# EAGLE design K0_Chrono77 (EAGLE 9.6.2)

## Sheet 1 of 2: Power Supply & MCU
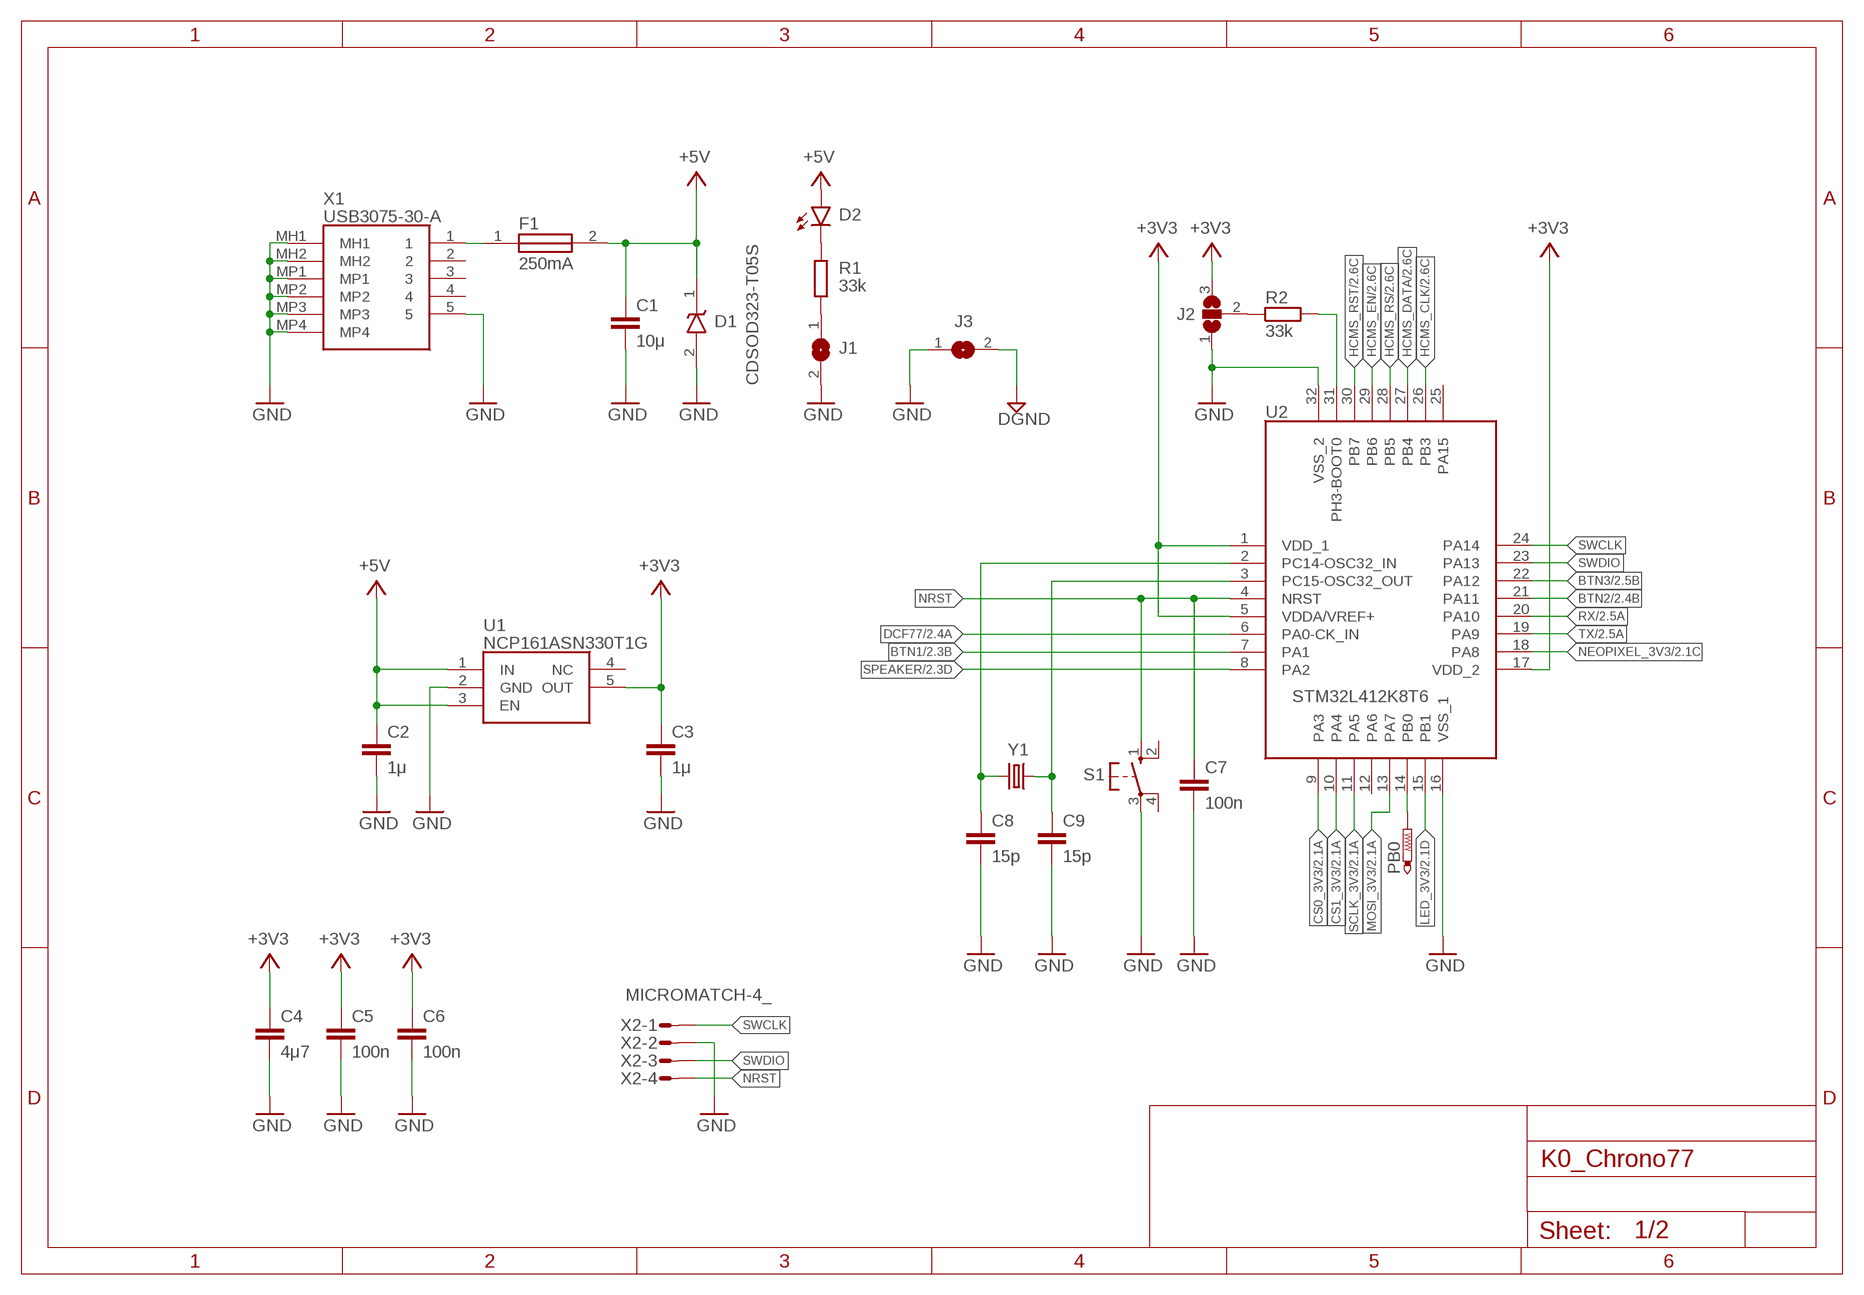
[diagram p0: schematic, sheet 1]

### Parts
C1  10μ  C_1206C1206  [C1206]
C2  1μ  C_0805  [C0805]
C3  1μ  C_0805  [C0805]
C4  4μ7  C_0805  [C0805]
C5  100n  C_0805  [C0805]
C6  100n  C_0805  [C0805]
C7  100n  C_0805  [C0805]
C8  15p  C_0805  [C0805]
C9  15p  C_0805  [C0805]
D1  CDSOD323-T05S  [SOD2513X114N]
D2  LED_0805  [CHIP-LED0805]
F1  SF-2410FP150T-2  [VARC6126X270N]
J1  SJ  [SJ]
J2  SJ2W  [SJ_2]
J3  SJ  [SJ]
PB0  PTR1TP14R  [TP14R]
R1  33k  R_0805  [R0805]
R2  33k  R_0805  [R0805]
S1  10-XX  [B3F-10XX]
U1  NCP161ASN330T1G  [SOT95P280X145-5N]
U2  STM32L412K8T6  [QFP80P900X900X160-32N]
X1  USB3075-30-A  [USB307530A]
X2  MICROMATCH-4_  [MICROMATCH-4]
Y1  CRYSTALTC26H  [TC26H]

### Nets
+3V3: C3.1 C4.1 C5.1 C6.1 J2.3 U1.5(OUT) U2.1(VDD_1) U2.5(VDDA/VREF+) U2.17(VDD_2) ; also sheet 2
+5V: C1.1 C2.1 D1.1(K) D2.A F1.2 U1.1(IN) U1.3(EN) ; also sheet 2
BTN1: U2.7(PA1) ; also sheet 2
BTN2: U2.21(PA11) ; also sheet 2
BTN3: U2.22(PA12) ; also sheet 2
CS0_3V3: U2.9(PA3) ; also sheet 2
CS1_3V3: U2.10(PA4) ; also sheet 2
DCF77: U2.6(PA0-CK_IN) ; also sheet 2
DGND: J3.2 ; also sheet 2
GND: C1.2 C2.2 C3.2 C4.2 C5.2 C6.2 C7.2 C8.2 C9.2 D1.2(A) J1.2 J2.1 J3.1 S1.3(P) U1.2(GND) U2.16(VSS_1) U2.32(VSS_2) X1.5 X1.MH1 X1.MH2 X1.MP1 X1.MP2 X1.MP3 X1.MP4 X2.2 ; also sheet 2
HCMS_CLK: U2.26(PB3) ; also sheet 2
HCMS_DATA: U2.27(PB4) ; also sheet 2
HCMS_EN: U2.29(PB6) ; also sheet 2
HCMS_RS: U2.28(PB5) ; also sheet 2
HCMS_RST: U2.30(PB7) ; also sheet 2
LED_3V3: U2.15(PB1) ; also sheet 2
MOSI_3V3: U2.13(PA7) ; also sheet 2
N$1: F1.1 X1.1
N$2: D2.C R1.2
N$3: J1.1 R1.1
N$4: R2.2 U2.31(PH3-BOOT0)
N$5: J2.2 R2.1
N$6: PB0.TP U2.14(PB0)
NEOPIXEL_3V3: U2.18(PA8) ; also sheet 2
NRST: C7.1 S1.1(S) U2.4(NRST) X2.4
OSC32_IN: C8.1 U2.2(PC14-OSC32_IN) Y1.2
OSC32_OUT: C9.1 U2.3(PC15-OSC32_OUT) Y1.1
RX: U2.20(PA10) ; also sheet 2
SCLK_3V3: U2.11(PA5) ; also sheet 2
SPEAKER: U2.8(PA2) ; also sheet 2
SWCLK: U2.24(PA14) X2.1
SWDIO: U2.23(PA13) X2.3
TX: U2.19(PA9) ; also sheet 2
Unconnected: S1.2(S1) S1.4(P1) U1.4(NC) U2.12(PA6) U2.25(PA15) X1.2 X1.3 X1.4

### Notes on the sheet
- 250mA

## Sheet 2 of 2: Additional Components
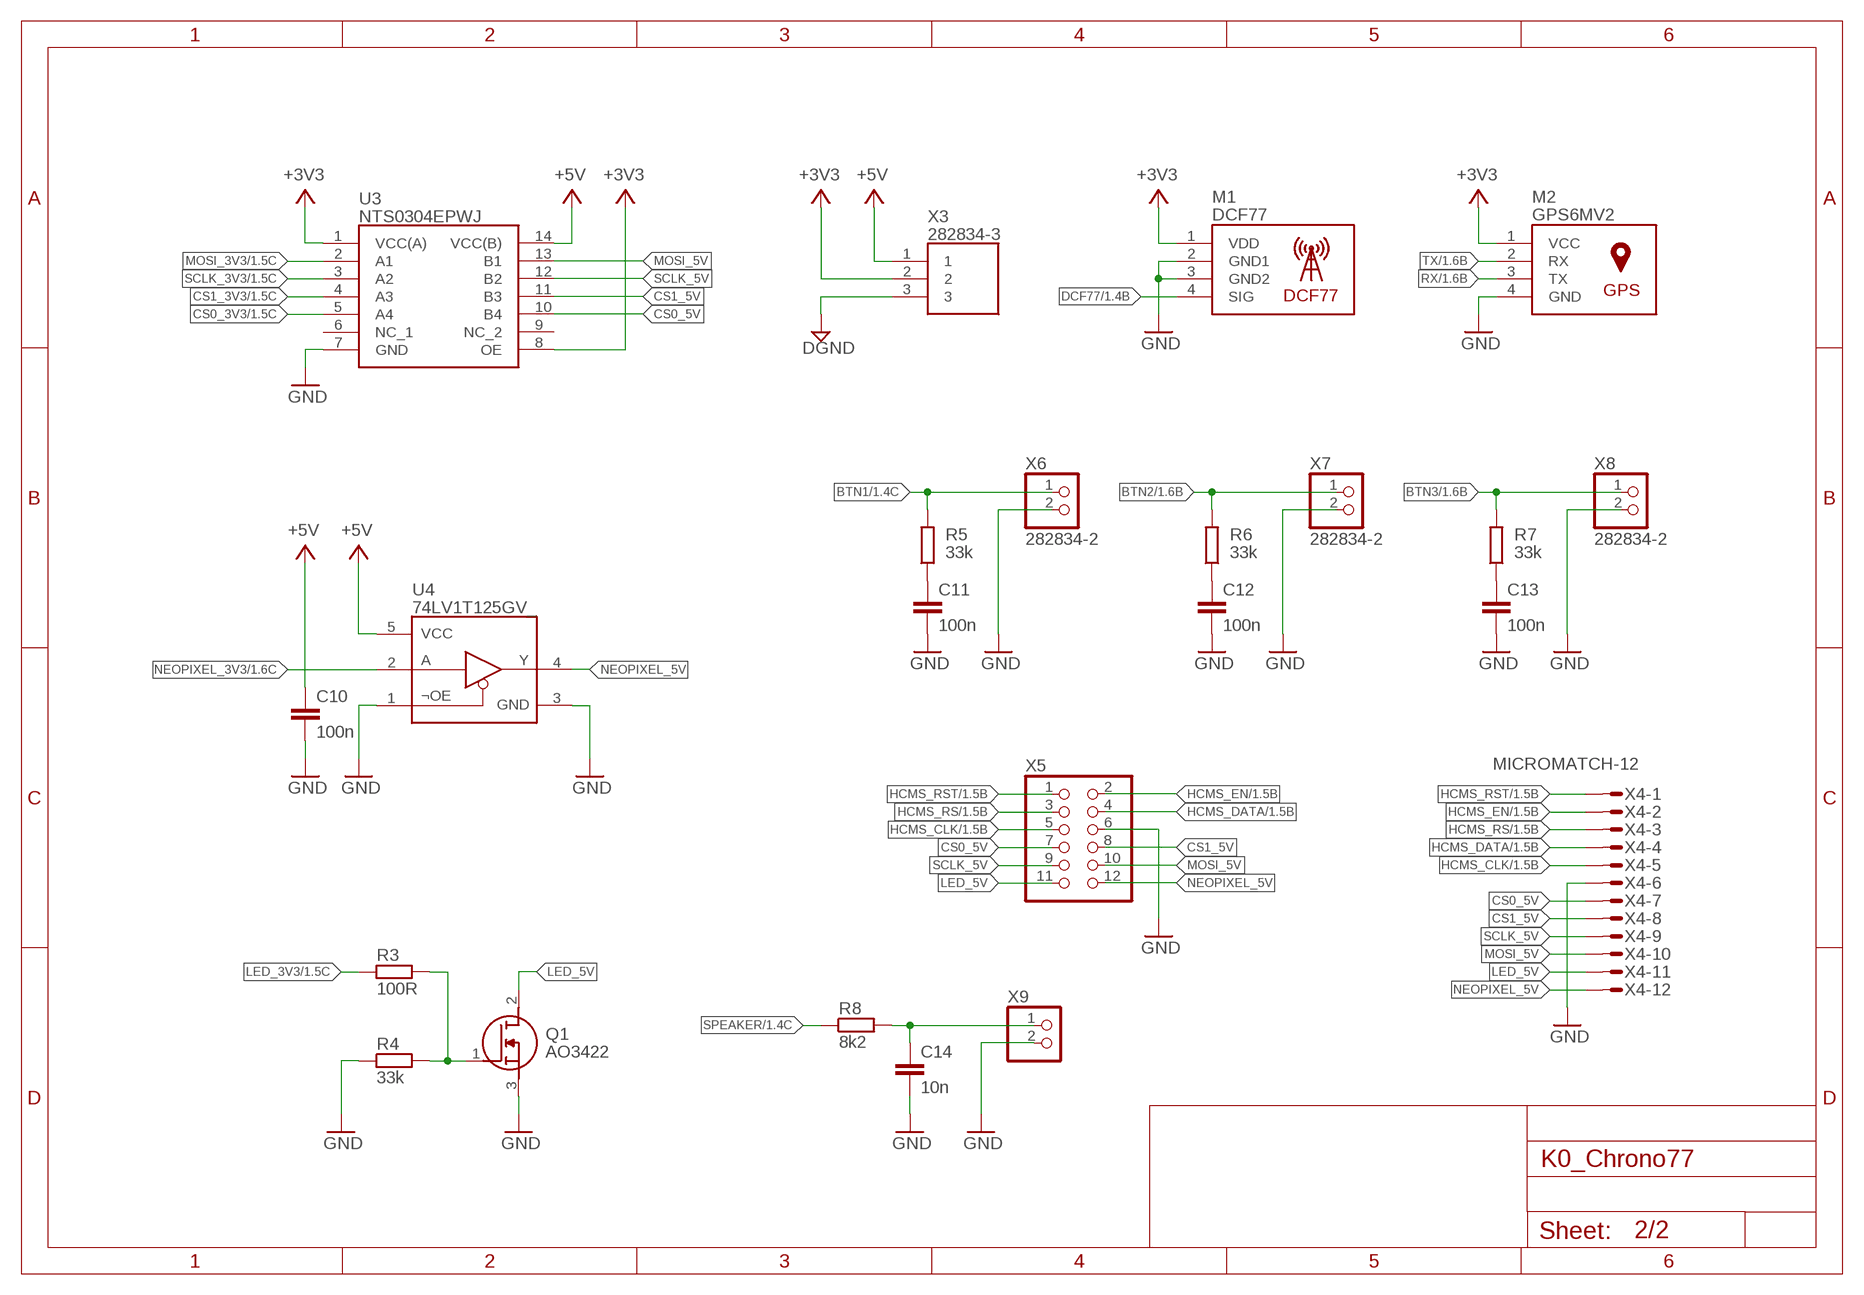
[diagram p1: schematic, sheet 2]

### Parts
C10  100n  C_0805  [C0805]
C11  100n  C_0805  [C0805]
C12  100n  C_0805  [C0805]
C13  100n  C_0805  [C0805]
C14  10n  C_0805  [C0805]
M1  DCF77  [DCF77]
M2  GPS6MV2  [GPS6MV2]
Q1  AO3422  [SOT95P237X112-3N]
R3  100R  R_0805  [R0805]
R4  33k  R_0805  [R0805]
R5  33k  R_0805  [R0805]
R6  33k  R_0805  [R0805]
R7  33k  R_0805  [R0805]
R8  8k2  R_0805  [R0805]
U3  NTS0304EPWJ  [SOP65P640X110-14N]
U4  74LV1T125GV_  [SOT753]
X3  282834-3  [SHDR3W100P0X254_1X3_808X650X10]
X4  MICROMATCH-12  [MICROMATCH-12]
X5  PINHD-2X6  [2X06]
X6  282834-2  [SHDR2W85P0X254_1X2_554X650X103]
X7  282834-2  [SHDR2W85P0X254_1X2_554X650X103]
X8  282834-2  [SHDR2W85P0X254_1X2_554X650X103]
X9  PINHD-1X2/90  [1X02/90]

### Nets
+3V3: M1.1(VDD) M2.1(VCC) U3.1(VCC(A)) U3.8(OE) X3.2 ; also sheet 1
+5V: C10.1 U3.14(VCC(B)) U4.5(VCC) X3.1 ; also sheet 1
BTN1: R5.2 X6.1 ; also sheet 1
BTN2: R6.2 X7.1 ; also sheet 1
BTN3: R7.2 X8.1 ; also sheet 1
CS0_3V3: U3.5(A4) ; also sheet 1
CS0_5V: U3.10(B4) X4.7 X5.7
CS1_3V3: U3.4(A3) ; also sheet 1
CS1_5V: U3.11(B3) X4.8 X5.8
DCF77: M1.4(SIG) ; also sheet 1
DGND: X3.3 ; also sheet 1
GND: C10.2 C11.2 C12.2 C13.2 C14.2 M1.2(GND1) M1.3(GND2) M2.4(GND) Q1.3(S) R4.1 U3.7(GND) U4.1(¬OE) U4.3(GND) X4.6 X5.6 X6.2 X7.2 X8.2 X9.2 ; also sheet 1
HCMS_CLK: X4.5 X5.5 ; also sheet 1
HCMS_DATA: X4.4 X5.4 ; also sheet 1
HCMS_EN: X4.2 X5.2 ; also sheet 1
HCMS_RS: X4.3 X5.3 ; also sheet 1
HCMS_RST: X4.1 X5.1 ; also sheet 1
LED_3V3: R3.1 ; also sheet 1
LED_5V: Q1.2(D) X4.11 X5.11
MOSI_3V3: U3.2(A1) ; also sheet 1
MOSI_5V: U3.13(B1) X4.10 X5.10
N$7: C11.1 R5.1
N$8: C12.1 R6.1
N$9: Q1.1(G) R3.2 R4.2
N$10: C13.1 R7.1
N$15: C14.1 R8.2 X9.1
NEOPIXEL_3V3: U4.2(A) ; also sheet 1
NEOPIXEL_5V: U4.4(Y) X4.12 X5.12
RX: M2.3(TX) ; also sheet 1
SCLK_3V3: U3.3(A2) ; also sheet 1
SCLK_5V: U3.12(B2) X4.9 X5.9
SPEAKER: R8.1 ; also sheet 1
TX: M2.2(RX) ; also sheet 1
Unconnected: U3.6(NC_1) U3.9(NC_2)

## Library data of the parts
C1 = K0N16_Keypad_Collection:C_1206: CAPACITOR, European symbol
C2-C14 = K0N16_Keypad_Collection:C_0805: CAPACITOR, European symbol
D1 = SamacSys_Parts:CDSOD323-T05S: ESD Suppressors / TVS Diodes Unidirectional Std Cap Source: Datasheet <https://datasheet.datasheetarchive.com/originals/dk/DKDS-12/224732.pdf>; ARROW_PART_NUMBER: CDSOD323-T03S; ARROW_PRICE-STOCK: https://www.arrow.com/en/products/cdsod323-t03s/bourns?region=nac; DESCRIPTION: ESD Suppressors / TVS Diodes Unidirectional Std Cap; HEIGHT: 1.14mm; MANUFACTURER_NAME: Bourns; MANUFACTURER_PART_NUMBER: CDSOD323-T03S; MOUSER_PART_NUMBER: 652-CDSOD323-T03S; MOUSER_PRICE-STOCK: https://www.mouser.co.uk/ProductDetail/Bourns/CDSOD323-T03S?qs=6S5Watp5UnKvHMaJwkOReA%3D%3D
D2 = K0N16_Keypad_Collection:LED_0805: LED OSRAM: - CHIPLED LG R971, LG N971, LY N971, LG Q971, LY Q971, LO R971, LY R971 LH N974, LH R974 LS Q976, LO Q976, LY Q976 LO Q996 - Hyper CHIPLED LW Q18S LB Q993, LB Q99A, LB R99A - SideLED LS A670, LO A670, LY A670, LG A670, LP A670 LB A673, LV A673, LT A673, LW A673 LH A674 LY A675 LS A676, LA A676, LO A676, LY A676, LW A676 LS A679, LY A679, LG A679 - Hyper Micro SIDELED® LS Y876, LA Y876, LO Y876, LY Y876 LT Y87S - SmartLED LW L88C, LW L88S LB L89C, LB L89S, LG L890 LS L89K, LO L89K, LY L89K LS L896, LA L896, LO L896, LY L896 - TOPLED LS T670, LO T670, LY T670, LG T670, LP T670 LSG T670, LSP T670, LSY T670, LOP T670, LYG T670 LG T671, LOG T671, LSG T671 LB T673, LV T673, LT T673, LW T673 LH T674 LS T676, LA T676, LO T676, LY T676, LB T676, LH T676, LSB T676, LW T676 LB T67C, LV T67C, LT T67C, LS T67K, LO T67K, LY T67K, LW E67C LS E67B, LA E67B, LO E67B, LY E67B, LB E67C, LV E67C, LT E67C LW T67C LS T679, LY T679, LG T679 LS T770, LO T770, LY T770, LG T770, LP T770 LB T773, LV T773, LT T773, LW T773 LH T774 LS E675, LA E675, LY E675, LS T675 LS T776, LA T776, LO T776, LY T776, LB T776 LHGB T686 LT T68C, LB T68C - Hyper Mini TOPLED® LB M676 - Mini TOPLED Santana® LG M470 LS M47K, LO M47K, LY M47K Source: http://www.osram.convergy.de LUXEON: - LUMILED® LXK2-PW12-R00, LXK2-PW12-S00, LXK2-PW14-U00, LXK2-PW14-V00 LXK2-PM12-R00, LXK2-PM12-S00, LXK2-PM14-U00 LXK2-PE12-Q00, LXK2-PE12-R00, LXK2-PE12-S00, LXK2-PE14-T00, LXK2-PE14-U00 LXK2-PB12-K00, LXK2-PB12-L00, LXK2-PB12-M00, LXK2-PB14-N00, LXK2-PB14-P00, LXK2-PB14-Q00 LXK2-PR12-L00, LXK2-PR12-M00, LXK2-PR14-Q00, LXK2-PR14-R00 LXK2-PD12-Q00, LXK2-PD12-R00, LXK2-PD12-S00 LXK2-PH12-R00, LXK2-PH12-S00 LXK2-PL12-P00, LXK2-PL12-Q00, LXK2-PL12-R00 Source: www.luxeon.com KINGBRIGHT: KA-3528ASYC Source: www.kingbright.com
F1 = SamacSys_Parts:SF-2410FP150T-2: Surface Mount Fuses Source: Datasheet <https://componentsearchengine.com/Datasheets/1/SF-2410FP150T-2.pdf>; ARROW_PART_NUMBER: SF-2410FP150T-2; ARROW_PRICE-STOCK: https://www.arrow.com/en/products/sf-2410fp150t-2/bourns; DESCRIPTION: Surface Mount Fuses; HEIGHT: 2.7mm; MANUFACTURER_NAME: Bourns; MANUFACTURER_PART_NUMBER: SF-2410FP150T-2; MOUSER_PART_NUMBER: 652-SF-2410FP150T-2; MOUSER_PRICE-STOCK: https://www.mouser.co.uk/ProductDetail/Bourns/SF-2410FP150T-2?qs=vLWxofP3U2ze3qY8eZya8g%3D%3D
J1 J3 = jumper:SJ: SMD solder JUMPER
J2 = jumper:SJ2W: SMD solder JUMPER
M1 = K0_Chrono77:DCF77
M2 = K0_Chrono77:GPS6MV2
PB0 = testpad:PTR1: TEST PIN
Q1 = SamacSys_Parts:AO3422: MOSFET N-CH 55V 2.1A SOT23 Source: Datasheet <http://aosmd.com/res/data_sheets/AO3422.pdf>; ARROW_PART_NUMBER: AO3422; ARROW_PRICE-STOCK: https://www.arrow.com/en/products/ao3422/alpha-and-omega-semiconductor?region=nac; DESCRIPTION: MOSFET N-CH 55V 2.1A SOT23; HEIGHT: 1.12mm; MANUFACTURER_NAME: Alpha & Omega Semiconductors; MANUFACTURER_PART_NUMBER: AO3422
R1-R8 = K0N16_Keypad_Collection:R_0805: RESISTOR, European symbol
S1 = switch-omron:10-XX: OMRON SWITCH; MPN: B3F-1000; OC_FARNELL: 176432; OC_NEWARK: 36M3542
U1 = K0N16_Keypad_Collection:NCP161ASN330T1G: ON SEMICONDUCTOR - NCP161ASN330T1G - Fixed LDO Voltage Regulator, 1.9V to 5.5V, 225mV drop, 3.3V/450mA out, SOT-23-5 Source: Datasheet <https://componentsearchengine.com/Datasheets/2/NCP161ASN330T1G.pdf>; ARROW_PART_NUMBER: NCP161ASN330T1G; ARROW_PRICE-STOCK: https://www.arrow.com/en/products/ncp161asn330t1g/on-semiconductor?region=nac; DESCRIPTION: ON SEMICONDUCTOR - NCP161ASN330T1G - Fixed LDO Voltage Regulator, 1.9V to 5.5V, 225mV drop, 3.3V/450mA out, SOT-23-5; HEIGHT: 1.45mm; MANUFACTURER_NAME: onsemi; MANUFACTURER_PART_NUMBER: NCP161ASN330T1G; MOUSER_PART_NUMBER: 863-NCP161ASN330T1G; MOUSER_PRICE-STOCK: https://www.mouser.co.uk/ProductDetail/onsemi/NCP161ASN330T1G?qs=vLWxofP3U2ze5zA%252BHmAd3w%3D%3D
U2 = K0N16_Keypad_Collection:STM32L412K8T6: STMICROELECTRONICS - STM32L412K8T6 - ARM MCU, STM32 Family STM32L4 Series Microcontrollers, ARM Cortex-M4, 32bit, 80 MHz, 128 KB, 40 KB Source: Datasheet <https://www.mouser.com/datasheet/2/389/stm32l412c8-1505426.pdf>; ARROW_PART_NUMBER: STM32L412K8T6; ARROW_PRICE-STOCK: https://www.arrow.com/en/products/stm32l412k8t6/stmicroelectronics?region=nac; DESCRIPTION: STMICROELECTRONICS - STM32L412K8T6 - ARM MCU, STM32 Family STM32L4 Series Microcontrollers, ARM Cortex-M4, 32bit, 80 MHz, 128 KB, 40 KB; HEIGHT: 1.6mm; MANUFACTURER_NAME: STMicroelectronics; MANUFACTURER_PART_NUMBER: STM32L412K8T6; MOUSER_PART_NUMBER: 511-STM32L412K8T6; MOUSER_PRICE-STOCK: https://www.mouser.co.uk/ProductDetail/STMicroelectronics/STM32L412K8T6?qs=l7cgNqFNU1gVMdP83FyqDw%3D%3D
U3 = SamacSys_Parts:NTS0304EPWJ: Translation - Voltage Levels 4-bit 0.9V Xlator w/AD & OD Source: Datasheet <http://www.nxp.com/docs/en/data-sheet/NTS0304E.pdf>; ARROW_PART_NUMBER: NTS0304EPWJ; ARROW_PRICE-STOCK: https://www.arrow.com/en/products/nts0304epwj/nxp-semiconductors?region=nac; DESCRIPTION: Translation - Voltage Levels 4-bit 0.9V Xlator w/AD & OD; HEIGHT: 1.1mm; MANUFACTURER_NAME: NXP; MANUFACTURER_PART_NUMBER: NTS0304EPWJ; MOUSER_PART_NUMBER: 771-NTS0304EPWJ; MOUSER_PRICE-STOCK: https://www.mouser.co.uk/ProductDetail/NXP-Semiconductors/NTS0304EPWJ?qs=u16ybLDytRZsxoYxiWudcg%3D%3D
U4 = K0N16_Keypad_Collection:74LV1T125GV
X1 = K0N16_Keypad_Collection:USB3075-30-A: GCT (GLOBAL CONNECTOR TECHNOLOGY) - USB3075-30-A - USB Connector, Micro USB Type B, USB 2.0, Receptacle, 5 Ways, Surface Mount, Right Angle Source: Datasheet <https://componentsearchengine.com/Datasheets/2/USB3075-30-A.pdf>; DESCRIPTION: GCT (GLOBAL CONNECTOR TECHNOLOGY) - USB3075-30-A - USB Connector, Micro USB Type B, USB 2.0, Receptacle, 5 Ways, Surface Mount, Right Angle; HEIGHT: 2.7mm; MANUFACTURER_NAME: GCT (GLOBAL CONNECTOR TECHNOLOGY); MANUFACTURER_PART_NUMBER: USB3075-30-A; MOUSER_PART_NUMBER: 640-USB3075-30-A; MOUSER_PRICE-STOCK: https://www.mouser.co.uk/ProductDetail/GCT/USB3075-30-A?qs=KUoIvG%2F9IlbGMJplbp1ybA%3D%3D
X2 = K0N16_Keypad_Collection:MICROMATCH-4: MicroMaTch 4 7-215464-4 / 0-215464-4 Drawing Number C-215464 DDEController.pdf
X3 = SamacSys_Parts:282834-3: Connector pcb 3 way 2.54mm Termi-Block Source: Datasheet <http://www.te.com/commerce/DocumentDelivery/DDEController?Action=showdoc&DocId=Customer Drawing282834C1pdfEnglishENG_CD_282834_C1.pdf282834-3>; ALLIED_NUMBER: 70087777; ALLIED_PRICE-STOCK: http://www.alliedelec.com/te-connectivity-282834-3/70087777/; DESCRIPTION: Connector pcb 3 way 2.54mm Termi-Block; HEIGHT: 10.3mm; MANUFACTURER_NAME: TE Connectivity; MANUFACTURER_PART_NUMBER: 282834-3; MOUSER_PART_NUMBER: 571-2828343; MOUSER_PRICE-STOCK: https://www.mouser.com/Search/Refine.aspx?Keyword=571-2828343; RS_PART_NUMBER: 1640792; RS_PRICE-STOCK: http://uk.rs-online.com/web/p/products/1640792
X4 = con-amp-micromatch:MICROMATCH-12: MicroMaTch 12 8-215464-2 / 1-215464-2 Drawing Number C-215464 DDEController.pdf; MF: FARNELL; MPN: 8-215464-2; OC_FARNELL: 3784666; OC_NEWARK: 95H9857
X5 = pinhead:PINHD-2X6: PIN HEADER
X6-X8 = SamacSys_Parts:282834-2: TE CONNECTIVITY / BUCHANAN - 282834-2 - TERMINAL BLOCK, WIRE TO BRD, 2POS, 16AWG Source: Datasheet <https://www.te.com/commerce/DocumentDelivery/DDEController?Action=srchrtrv&DocNm=282834&DocType=Customer Drawing&DocLang=English&DocFormat=pdf&PartCntxt=282834-2>; ALLIED_NUMBER: 70086732; ALLIED_PRICE-STOCK: https://www.alliedelec.com/te-connectivity-282834-2/70086732/; DESCRIPTION: TE CONNECTIVITY / BUCHANAN - 282834-2 - TERMINAL BLOCK, WIRE TO BRD, 2POS, 16AWG; HEIGHT: 10.3mm; MANUFACTURER_NAME: TE CONNECTIVITY / BUCHANAN; MANUFACTURER_PART_NUMBER: 282834-2
X9 = pinhead:PINHD-1X2: PIN HEADER
Y1 = crystal:CRYSTAL: CRYSTAL; OC_FARNELL: unknown; OC_NEWARK: unknown

## Board
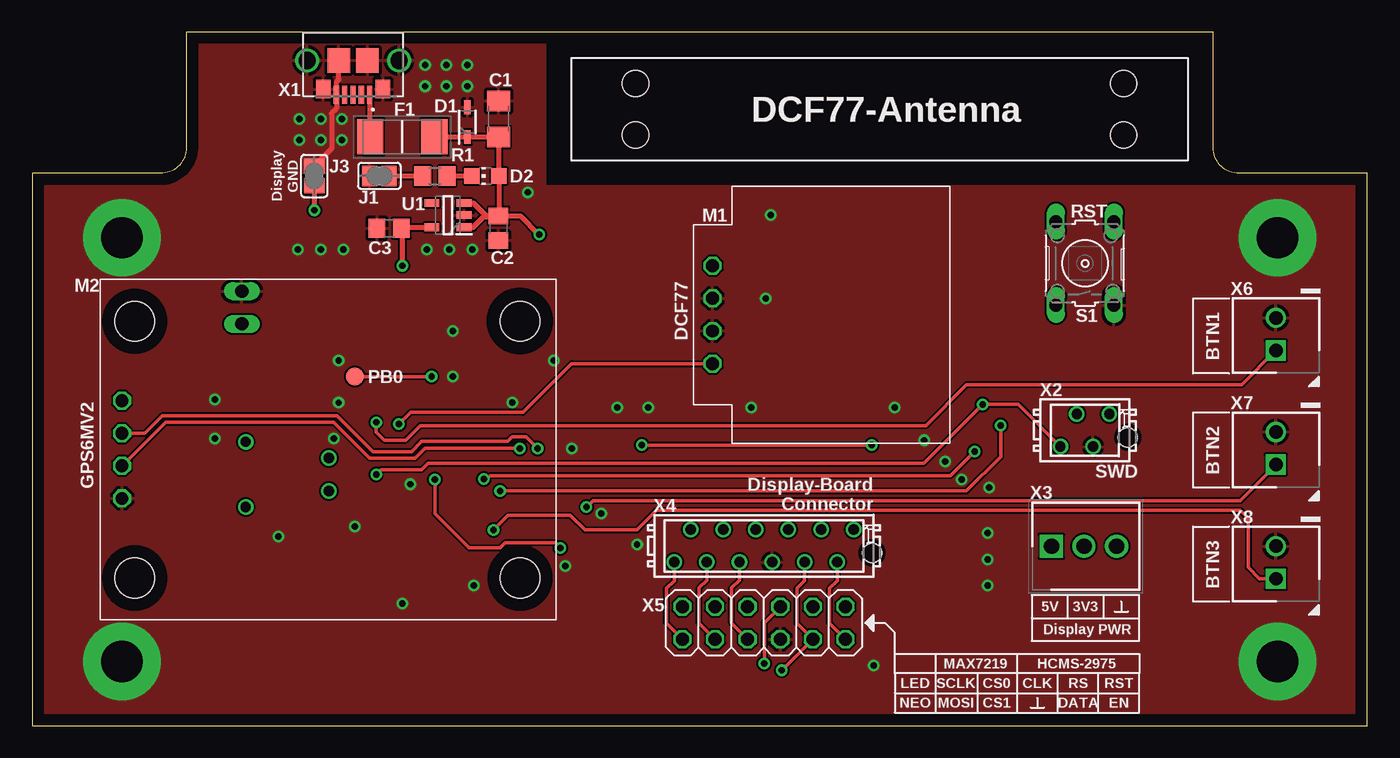
[diagram p2: board, top side]
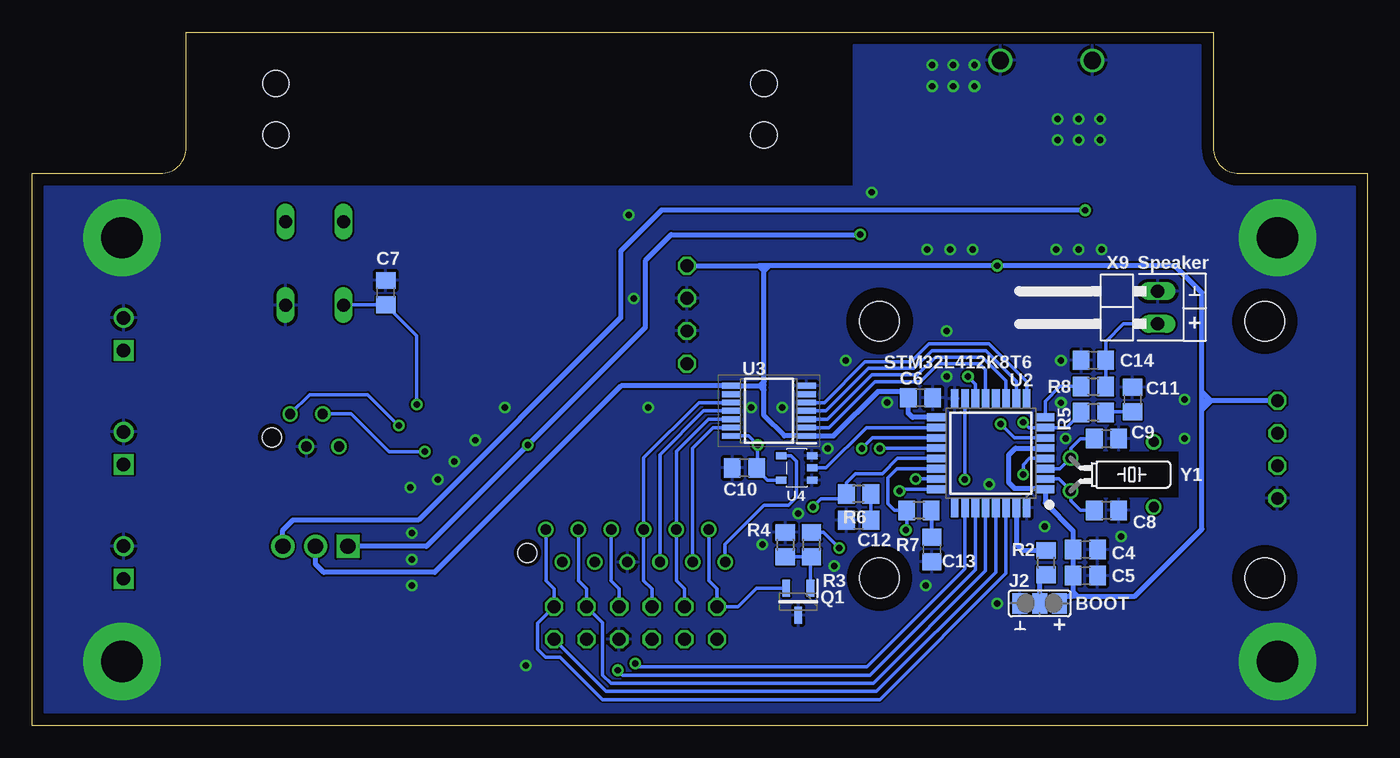
[diagram p3: board, bottom side, seen from below]

Size 104 x 54 mm. Coordinates in mm from the lower left corner, seen from the top.
Outline: 0,0 104,0 104,43 94,43 arc-90 92,45 92,54 12,54 12,45 arc-90 10,43 0,43 0,0
Copper layers (1*16): Top 0.035mm / dielectric 1.5mm / Bottom 0.035mm
Design rules "aisler_2_layer": minimum track width 0.2mm, minimum drill 0.3mm, track to track 0.15mm, track to pad 0.15mm, pad to pad 0.15mm, via to via 0.15mm, smd to smd 0.15mm, copper to edge 0.3mm, drill to drill 0.25mm, minimum pad ring 0.2mm, minimum via ring 0.2mm, stop-mask expansion 4mil, vias tented up to drill 0mil, thermal gap 10mil
Holes 2.05 mm at 47,50 85,50 47,46 85,46
tRestrict: area 5.5,29 to 10.5,34; area 35.5,29 to 40.5,34; area 35.5,9 to 40.5,14; area 5.5,9 to 10.5,14
bRestrict: area 14.7,17.8 to 22.4,21.3; area 35.5,29 to 40.5,34; area 35.5,9 to 40.5,14; area 5.5,9 to 10.5,14; area 5.5,29 to 10.5,34

### Footprints (pad centres in the part's own frame; a part is rotated, then mirrored left to right if it is on the bottom)
C1206 = smd 1.6 x 1.8: 1 -1.4,0; 2 1.4,0
C0805 = smd 1.3 x 1.5: 1 -0.95,0; 2 0.95,0
SOD2513X114N = smd 1.075 x 0.5: 1 -1.15,0; 2 1.15,0
CHIP-LED0805 = smd 1.2 x 1.2: A 0,-1.05; C 0,1.05
VARC6126X270N = smd 2.05 x 2.75: 1 -2.5,0; 2 2.5,0
SJ = smd 1.168 x 1.6: 1 -0.762,0; 2 0.762,0
SJ_2 = smd 1.168 x 1.6: 1 -1.524,0; 2 0,0; 3 1.524,0
DCF77 = drill 1 octagon: 1 0,3.81; 2 0,1.27; 3 0,-1.27; 4 0,-3.81
GPS6MV2 = drill 1 octagon: 1 0,3.81; 2 0,1.27; 3 0,-1.27; 4 0,-3.81 | hole 3.1: 1,-10; 1,10; 31,10; 31,-10
TP14R = smd 1.4 x 1.4: TP 0,0
SOT95P237X112-3N = smd 1.3 x 0.6: 1 -1.05,0.95; 2 -1.05,-0.95; 3 1.05,0
R0805 = smd 1.3 x 1.5: 1 -0.95,0; 2 0.95,0
B3F-10XX = drill 1.016 long: 1 -3.251,2.261; 2 3.251,2.261; 3 -3.251,-2.261; 4 3.251,-2.261
SOT95P280X145-5N = smd 1.15 x 0.6: 1 -1.25,0.95; 2 -1.25,0; 3 -1.25,-0.95; 4 1.25,-0.95; 5 1.25,0.95
QFP80P900X900X160-32N = smd 1.475 x 0.6: 1 -4.238,2.8; 2 -4.238,2; 3 -4.238,1.2; 4 -4.238,0.4; 5 -4.238,-0.4; 6 -4.238,-1.2; 7 -4.238,-2; 8 -4.238,-2.8; 17 4.238,-2.8; 18 4.238,-2; 19 4.238,-1.2; 20 4.238,-0.4; 21 4.238,0.4; 22 4.238,1.2; 23 4.238,2; 24 4.238,2.8 | smd 0.6 x 1.475: 9 -2.8,-4.238; 10 -2,-4.238; 11 -1.2,-4.238; 12 -0.4,-4.238; 13 0.4,-4.238; 14 1.2,-4.238; 15 2,-4.238; 16 2.8,-4.238; 25 2.8,4.238; 26 2,4.238; 27 1.2,4.238; 28 0.4,4.238; 29 -0.4,4.238; 30 -1.2,4.238; 31 -2,4.238; 32 -2.8,4.238
SOP65P640X110-14N = smd 1.475 x 0.45: 1 -2.938,1.95; 2 -2.938,1.3; 3 -2.938,0.65; 4 -2.938,0; 5 -2.938,-0.65; 6 -2.938,-1.3; 7 -2.938,-1.95; 8 2.938,-1.95; 9 2.938,-1.3; 10 2.938,-0.65; 11 2.938,0; 12 2.938,0.65; 13 2.938,1.3; 14 2.938,1.95
SOT753 = smd 0.8 x 0.55: 1 -1.2,0.95; 2 -1.2,0; 3 -1.2,-0.95; 4 1.2,-0.95; 5 1.2,0.95
USB307530A = smd 0.4 x 1.4: 1 -1.3,2.65; 2 -0.65,2.65; 3 0,2.65; 4 0.65,2.65; 5 1.3,2.65 | drill 1.329 pad 1.85: MH1 -3.575,0; MH2 3.575,0 | smd 1.75 x 1.9: MP1 -1.125,0; MP2 1.125,0 | smd 1.15 x 1.45: MP3 -2.32,2.23; MP4 2.32,2.23
MICROMATCH-4 = drill 0.8: 1 1.905,1.27; 2 0.635,-1.27; 3 -0.635,1.27; 4 -1.905,-1.27 | hole 1.5: 3.34,-0.55
SHDR3W100P0X254_1X3_808X650X10 = drill 1.2 pad 1.8 square: 1 0,0 | drill 1.2 pad 1.8: 2 2.54,0; 3 5.08,0
MICROMATCH-12 = drill 0.813: 1 6.985,1.27; 2 5.715,-1.27; 3 4.445,1.27; 4 3.175,-1.27; 5 1.905,1.27; 6 0.635,-1.27; 7 -0.635,1.27; 8 -1.905,-1.27; 9 -3.175,1.27; 10 -4.445,-1.27; 11 -5.715,1.27; 12 -6.985,-1.27 | hole 1.5: 8.42,-0.55
2X06 = drill 1.016 octagon: 1 -6.35,-1.27; 2 -6.35,1.27; 3 -3.81,-1.27; 4 -3.81,1.27; 5 -1.27,-1.27; 6 -1.27,1.27; 7 1.27,-1.27; 8 1.27,1.27; 9 3.81,-1.27; 10 3.81,1.27; 11 6.35,-1.27; 12 6.35,1.27
SHDR2W85P0X254_1X2_554X650X103 = drill 1.05 pad 1.575 square: 1 0,0 | drill 1.05 pad 1.575: 2 2.54,0
1X02/90 = drill 1.016 long: 1 -1.27,-3.81; 2 1.27,-3.81
TC26H = drill 0.813: 1 -1.27,0; 2 1.27,0

### Placement (x,y rotation side)
C1  36.32,47.24 90 top
C2  36.32,38.73 270 top
C3  27.81,38.73 180 top
C4  21.97,13.72 0 bottom
C5  21.97,11.68 0 bottom
C6  34.8,25.53 0 bottom
C7  76.45,33.72 90 bottom
C8  20.32,16.76 0 bottom
C9  20.32,22.35 0 bottom
C10  48.51,20.07 180 bottom
C11  18.29,25.4 90 bottom
C12  39.62,16 180 bottom
C13  33.91,13.72 270 bottom
C14  21.34,28.45 180 bottom
D1  33.91,46.99 90 top
D2  35.31,42.8 90 top
F1  28.83,45.85 0 top
J1  27.05,42.8 180 top
J2  25.53,9.53 0 bottom
J3  21.97,42.8 270 top
M1  53,32 0 top
M2  7,21.5 0 top
PB0  25.15,27.18 0 top
Q1  44.32,9.65 270 bottom
R1  31.37,42.8 0 top
R2  25.02,12.7 90 bottom
R3  43.31,14.1 270 bottom
R4  45.34,14.1 270 bottom
R5  21.34,24.38 180 bottom
R6  39.62,18.03 180 bottom
R7  34.92,16.76 180 bottom
R8  21.34,26.42 0 bottom
S1  82,36 90 top
U1  32.38,39.75 180 top
U2  29.34,21.21 180 bottom
U3  46.61,24.51 180 bottom
U4  44.45,20.07 180 bottom
X1  25,51.79 180 top
X2  82,23 0 top
X3  79.39,13.97 0 top
X4  57,14 0 top
X5  57,8 180 top
X6  96.87,29.22 90 top
X7  96.87,20.33 90 top
X8  96.87,11.44 90 top
X9  20.15,32.56 90 bottom
Y1  23.11,19.56 270 bottom

### Tracks (layer width: path | path; a pad name or v marks a point on that pad's centre or on a via)
+3V3  (via drill 0.5)
  Top 0.406: U1.5 28.76,38.8 C3.1 28.83,38.67 v28.83,35.81
  Bottom 0.406: U2.5 27.41,21.61 27.94,21.08 27.94,18.92 27.5,18.48 25.18,18.48 U2.1 25.1,17.35 22.92,15.17 C4.1 C5.1 22.92,10.41 | 46.61,35.81 v28.83,35.81 14.98,35.81 12.89,33.72 12.89,26.01 | 46.61,35.81 46.99,35.81 | 46.99,35.81 47.37,35.81 | 12.89,25.31 12.19,25.31 | 22.61,10.09 18.1,10.09 12.89,15.3 12.89,24.61 | 22.61,10.09 22.92,10.09 | 22.92,10.41 22.92,10.09 | J2.3 24,9.78 23.69,10.09 23.24,10.09 | 23.24,10.09 22.92,10.09 | 22.61,10.09 22.92,10.41 | 22.92,10.41 23.24,10.09 | 12.89,24.61 12.89,25.31 | 12.89,25.31 12.89,26.01 | 12.19,25.31 12.89,26.01 | 12.89,24.61 12.19,25.31 | U2.17 35.43,24 35.75,24.32 C6.1 36.26,26.04 38.1,26.04 41.57,22.56 U3.1 45.42,22.56 46.99,24.13 46.99,26.12 | 46.99,26.12 46.99,26.54 | 46.99,26.54 46.99,26.8 | 46.99,26.8 46.99,35.43 | 46.99,35.43 46.99,35.81 | 46.61,35.81 46.99,35.43 | 46.99,35.43 47.37,35.81 | 47.33,26.46 U3.8 58.12,26.46 72.64,11.94 81.28,11.94 81.93,12.59 X3.2 | 47.33,26.46 47.07,26.46 46.99,26.54 | 46.99,26.8 47.33,26.46 | 46.99,26.12 47.33,26.46 | M2.1 12.19,25.31 | M1.1 47.37,35.81
+5V  (via drill 0.5)
  Top 0.254: v65.41,21.84 v47.5,21.84
  Top 0.406: F1.2 D1.1 C1.1 36.32,42.8 D2.A 36.36,39.72 C2.1 | U1.1 34.36,38.8 35.18,39.62 36.26,39.62 C2.1 | U1.3 34.36,40.7 35.31,39.75 36.26,39.75 C2.1 | v39.5,38.23 38.04,39.69 C2.1
  Bottom 0.254: U4.5 46.74,19.12 47.56,19.94 C10.1 47.5,20.13 v47.5,21.84 48.22,22.56 U3.14
  Bottom 0.406: v39.5,38.23 54.23,38.23 56.26,36.2 56.26,30.99 v65.41,21.84 73.28,13.97 X3.1
BTN1  (via drill 0.5)
  Top 0.254: X6.1 94.2,26.55 72.78,26.55 69.6,23.37 30.23,23.37 29.08,22.23 27.43,22.23 26.8,22.86 v26.8,23.62
  Bottom 0.254: R5.2 23.46,23.21 U2.7 26.38,23.21 v26.8,23.62
BTN2  (via drill 0.5)
  Top 0.254: v43.18,17.02 43.69,17.53 94.11,17.53 96.87,20.29 X7.1
  Bottom 0.254: U2.21 36.59,20.81 37.78,19.62 39.88,19.62 40.57,18.92 R6.2 40.95,17.65 42.55,17.65 v43.18,17.02
BTN3  (via drill 0.5)
  Top 0.254: X8.1 95.6,11.44 94.71,12.33 94.71,16.16 94.11,16.76 48.64,16.76 47.12,15.24 43.05,15.24 41.91,16.38 37.08,16.38 v35.94,15.24
  Bottom 0.254: U2.22 36.63,20.01 37.34,19.3 37.34,17.27 36.83,16.76 R7.2 35.88,15.31 v35.94,15.24
CS0_3V3
  Bottom 0.254: U3.5 42.28,25.16 39.12,28.32 35.56,28.32 34.16,29.72 29.46,29.72 26.54,26.79 U2.9
CS0_5V
  Bottom 0.254: X5.7 55.73,10.67 56.37,11.3 X4.7 56.37,20.85 52.05,25.16 U3.10
CS1_3V3
  Bottom 0.254: U3.4 42.16,24.51 38.86,27.81 35.31,27.81 33.91,29.21 29.72,29.21 27.34,26.83 U2.10
CS1_5V
  Top 0.254: X5.8 54.48,7.98 54.48,10.72 55.09,11.33 X4.8
  Bottom 0.254: U3.11 51.69,24.51 55.09,21.11 X4.8
DCF77  (via drill 0.5)
  Top 0.254: v28.57,23.5 29.46,24.38 38.23,24.38 42.03,28.19 M1.4
  Bottom 0.254: U2.6 27.49,22.41 v28.57,23.5
DGND  (via drill 0.5)
  Top 0.406: J3.2 v21.97,40.13
  Bottom 0.406: v21.97,40.13 54.99,40.13 58.17,36.96 58.17,31.75 73.91,16 83.69,16 84.47,15.22 X3.3
GND  (via drill 0.5, 3.2 pad 6)
  Top 0.406: J3.1 23.32,44.91 23.32,47.67 23.7,48.05 X1.5 23.7,50.12 23.88,50.29 X1.MP2
  other vias: 7,38 7,5 97,5 97,38 29.46,18.8 25.15,15.49 28.83,9.53 23.88,25.15 32.77,27.18 23.88,28.45 42.04,21.59 41.53,12.45 44.32,16.51 47.12,14.1 48.01,24.77 45.59,24.77 40.64,28.45 30.73,37.08 32.51,37.08 34.29,37.08 20.7,37.08 22.48,37.08 24.26,37.08 19.18,14.73 14.22,22.35 65.53,4.7 56.01,24.77 69.47,22.23 67.18,24.77 71.12,20.57 72.39,19.18 74.55,18.54 74.42,14.99 74.42,12.95 57.15,33.27 74.42,10.92 23.5,22.35 34.42,10.92 32.77,30.73 24.13,45.59 22.48,45.59 20.83,45.59 24.13,47.24 22.48,47.24 20.83,47.24 33.91,49.78 32.26,49.78 30.61,49.78 30.61,51.44 32.26,51.44 33.91,51.44 38.61,41.53 57.53,39.75 14.22,25.4 37.41,25.17
  pour Top: 1,1 103,1 103,42 40,42 40,53 13,53 13,45 arc-90 10,42 1,42
  pour Bottom: 1,1 103,1 103,42 40,42 40,53 13,53 13,45 arc-90 10,42 1,42
  pour Top (no thermals): 20.81,48.2 20.81,43.01 24.87,43.01 24.87,48.2
HCMS_CLK  (via drill 0.5)
  Top 0.254: v57.02,4.83 57.02,8.02 X5.5
  Bottom 0.254: U2.26 31.34,12.22 38.99,4.57 56.77,4.57 v57.02,4.83 | X4.5 58.91,11.3 58.27,10.67 X5.5
HCMS_DATA  (via drill 0.5)
  Top 0.254: X4.4 60.17,11.3 59.56,10.69 59.56,7.98 X5.4 v58.4,4.32
  Bottom 0.254: U2.27 30.54,12.13 38.73,3.94 58.02,3.94 v58.4,4.32
HCMS_EN
  Top 0.254: X5.2 62.1,7.98 62.1,10.69 62.72,11.3 X4.2
  Bottom 0.254: U2.29 28.94,11.96 38.23,2.67 59.29,2.67 X5.2
HCMS_RS
  Bottom 0.254: U2.28 29.74,12.05 38.48,3.3 58.93,3.3 59.56,3.94 59.56,8.02 X5.3 60.81,10.67 61.45,11.3 X4.3
HCMS_RST
  Bottom 0.254: U2.30 28.14,11.87 37.97,2.03 59.56,2.03 62.87,5.33 64.01,5.33 64.64,5.97 64.64,7.98 X5.1 63.35,10.67 63.98,11.3 X4.1
LED_3V3  (via drill 0.5)
  Top 0.254: v31.37,19.18 31.37,16.51 34.04,13.84 36.45,13.84 36.83,14.22 40.77,14.22 v41.15,13.84
  Bottom 0.254: U2.15 31.34,19.21 v31.37,19.18 | v41.15,13.84 42.35,15.05 R3.1
LED_5V
  Bottom 0.254: X4.11 51.28,11.3 50.65,10.67 X5.11 49.02,9.27 47.59,10.7 Q1.2
MOSI_3V3
  Bottom 0.254: U3.2 41.94,23.21 38.35,26.8 34.8,26.8 33.4,28.19 30.23,28.19 29.74,27.7 U2.13
MOSI_5V
  Top 0.254: X5.10 51.94,7.98 51.94,10.72 52.55,11.33 X4.10
  Bottom 0.254: U3.13 50.96,23.21 52.55,21.61 X4.10
N$1
  Top 0.406: X1.1 26.3,45.85 F1.1
N$2
  Top 0.406: R1.2 D2.C
N$3
  Top 0.406: J1.1 R1.1
N$4
  Bottom 0.406: U2.31 27.34,14.13 26.86,13.65 R2.2
N$5
  Bottom 0.406: J2.2 25.53,11.24 R2.1
N$6  (via drill 0.5)
  Top 0.254: v31.11,27.18 PB0.TP
  Bottom 0.254: v31.11,27.18 30.54,26.6 U2.14
N$7
  Bottom 0.254: C11.1 20.32,24.45
  Bottom 0.305: 20.32,24.45 R5.1
N$8
  Bottom 0.254: C12.1 R6.1
N$9
  Bottom 0.254: Q1.1 43.37,13.08 R3.2 R4.2
N$10
  Bottom 0.305: R7.1 33.98,14.73 C13.1
N$15
  Bottom 0.254: R8.2 C14.1 20.39,29.91 19.01,31.29 X9.1
N$16  (via drill 0.8)
  other vias: 16.64,22.1
N$17  (via drill 0.8)
  other vias: 16.64,17.02
NEOPIXEL_3V3
  Bottom 0.254: U2.18 39.02,23.21 42.16,20.07 U4.2
NEOPIXEL_5V
  Top 0.254: X5.12 49.4,7.98 49.4,10.69 50.02,11.3 X4.12
  Bottom 0.254: U4.4 44.89,21.02 44.45,20.57 44.45,17.78 45.09,17.14 46.99,17.14 50.02,14.12 X4.12
NRST  (via drill 0.5)
  Top 0.254: v26.8,19.56 27.18,19.94 30.35,19.94 30.86,20.45 69.47,20.45 v74.04,25.02 76.81,25.02 X2.4
  Bottom 0.254: U2.4 26.31,20.81 26.8,20.32 v26.8,19.56 | S1.1 79.72,32.77 C7.1 74.04,30.36 v74.04,25.02
OSC32_IN
  Bottom 0.254: U2.2 24.04,19.21 Y1.2 23.11,17.53 22.35,16.76 C8.1
OSC32_OUT
  Bottom 0.254: U2.3 23.93,20.01 Y1.1 23.11,21.59 22.35,22.35 C9.1
RX  (via drill 0.5)
  Top 0.254: v37.97,21.59 30.61,21.59 29.84,20.83 26.29,20.83 23.5,23.62 10.39,23.62 M2.3
  Bottom 0.254: U2.20 37.95,21.61 v37.97,21.59
SCLK_3V3
  Bottom 0.254: U2.11 28.14,26.87 29.97,28.7 33.66,28.7 35.05,27.3 38.61,27.3 42.05,23.86 U3.3
SCLK_5V
  Bottom 0.254: X5.9 53.19,10.67 53.83,11.3 X4.9 53.83,21.36 51.32,23.86 U3.12
SPEAKER
  Bottom 0.254: R8.1 23.94,26.42 25.1,25.25 U2.8
SWCLK  (via drill 0.5)
  Top 0.254: v36.45,18.29 72.77,18.29 75.44,20.95 v75.44,23.37
  Bottom 0.254: v36.45,18.29 36.33,18.41 U2.24 | X2.1 82.39,25.78 77.85,25.78 v75.44,23.37
SWDIO  (via drill 0.5)
  Top 0.254: v35.18,19.21 35.43,19.21 35.69,19.46 71.53,19.46 v73.41,21.34
  Bottom 0.254: v35.18,19.21 U2.23 | v73.41,21.34 76.2,21.34 79.13,24.27 X2.3
TX  (via drill 0.5)
  Top 0.254: v39.37,21.59 38.47,22.49 37.4,22.49 37.04,22.14 30.35,22.14 29.55,21.34 26.54,21.34 23.75,24.13 10.14,24.13 8.78,22.77 M2.2
  Bottom 0.254: U2.19 38.55,22.41 v39.37,21.59

### Text on the board
tPlace: DCF77-Antenna | Display / GND | RST | BTN1 | BTN2 | SWD | Display-Board / Connector | BTN3 | 5V | 3V3 | Display PWR | MAX7219 | HCMS-2975 | LED | SCLK | CS0 | CLK | RS | RST | NEO | MOSI | CS1 | DATA | EN
bPlace: Speaker | + | BOOT | +
tStop: K0_Chrono77 - Mainboard / Version 1.0 - 29.01.2023 / Design by Hannes Heilmann